# Altium schematic sheet ZBoard_2022-08-04.schdoc
size 444 x 306 mm
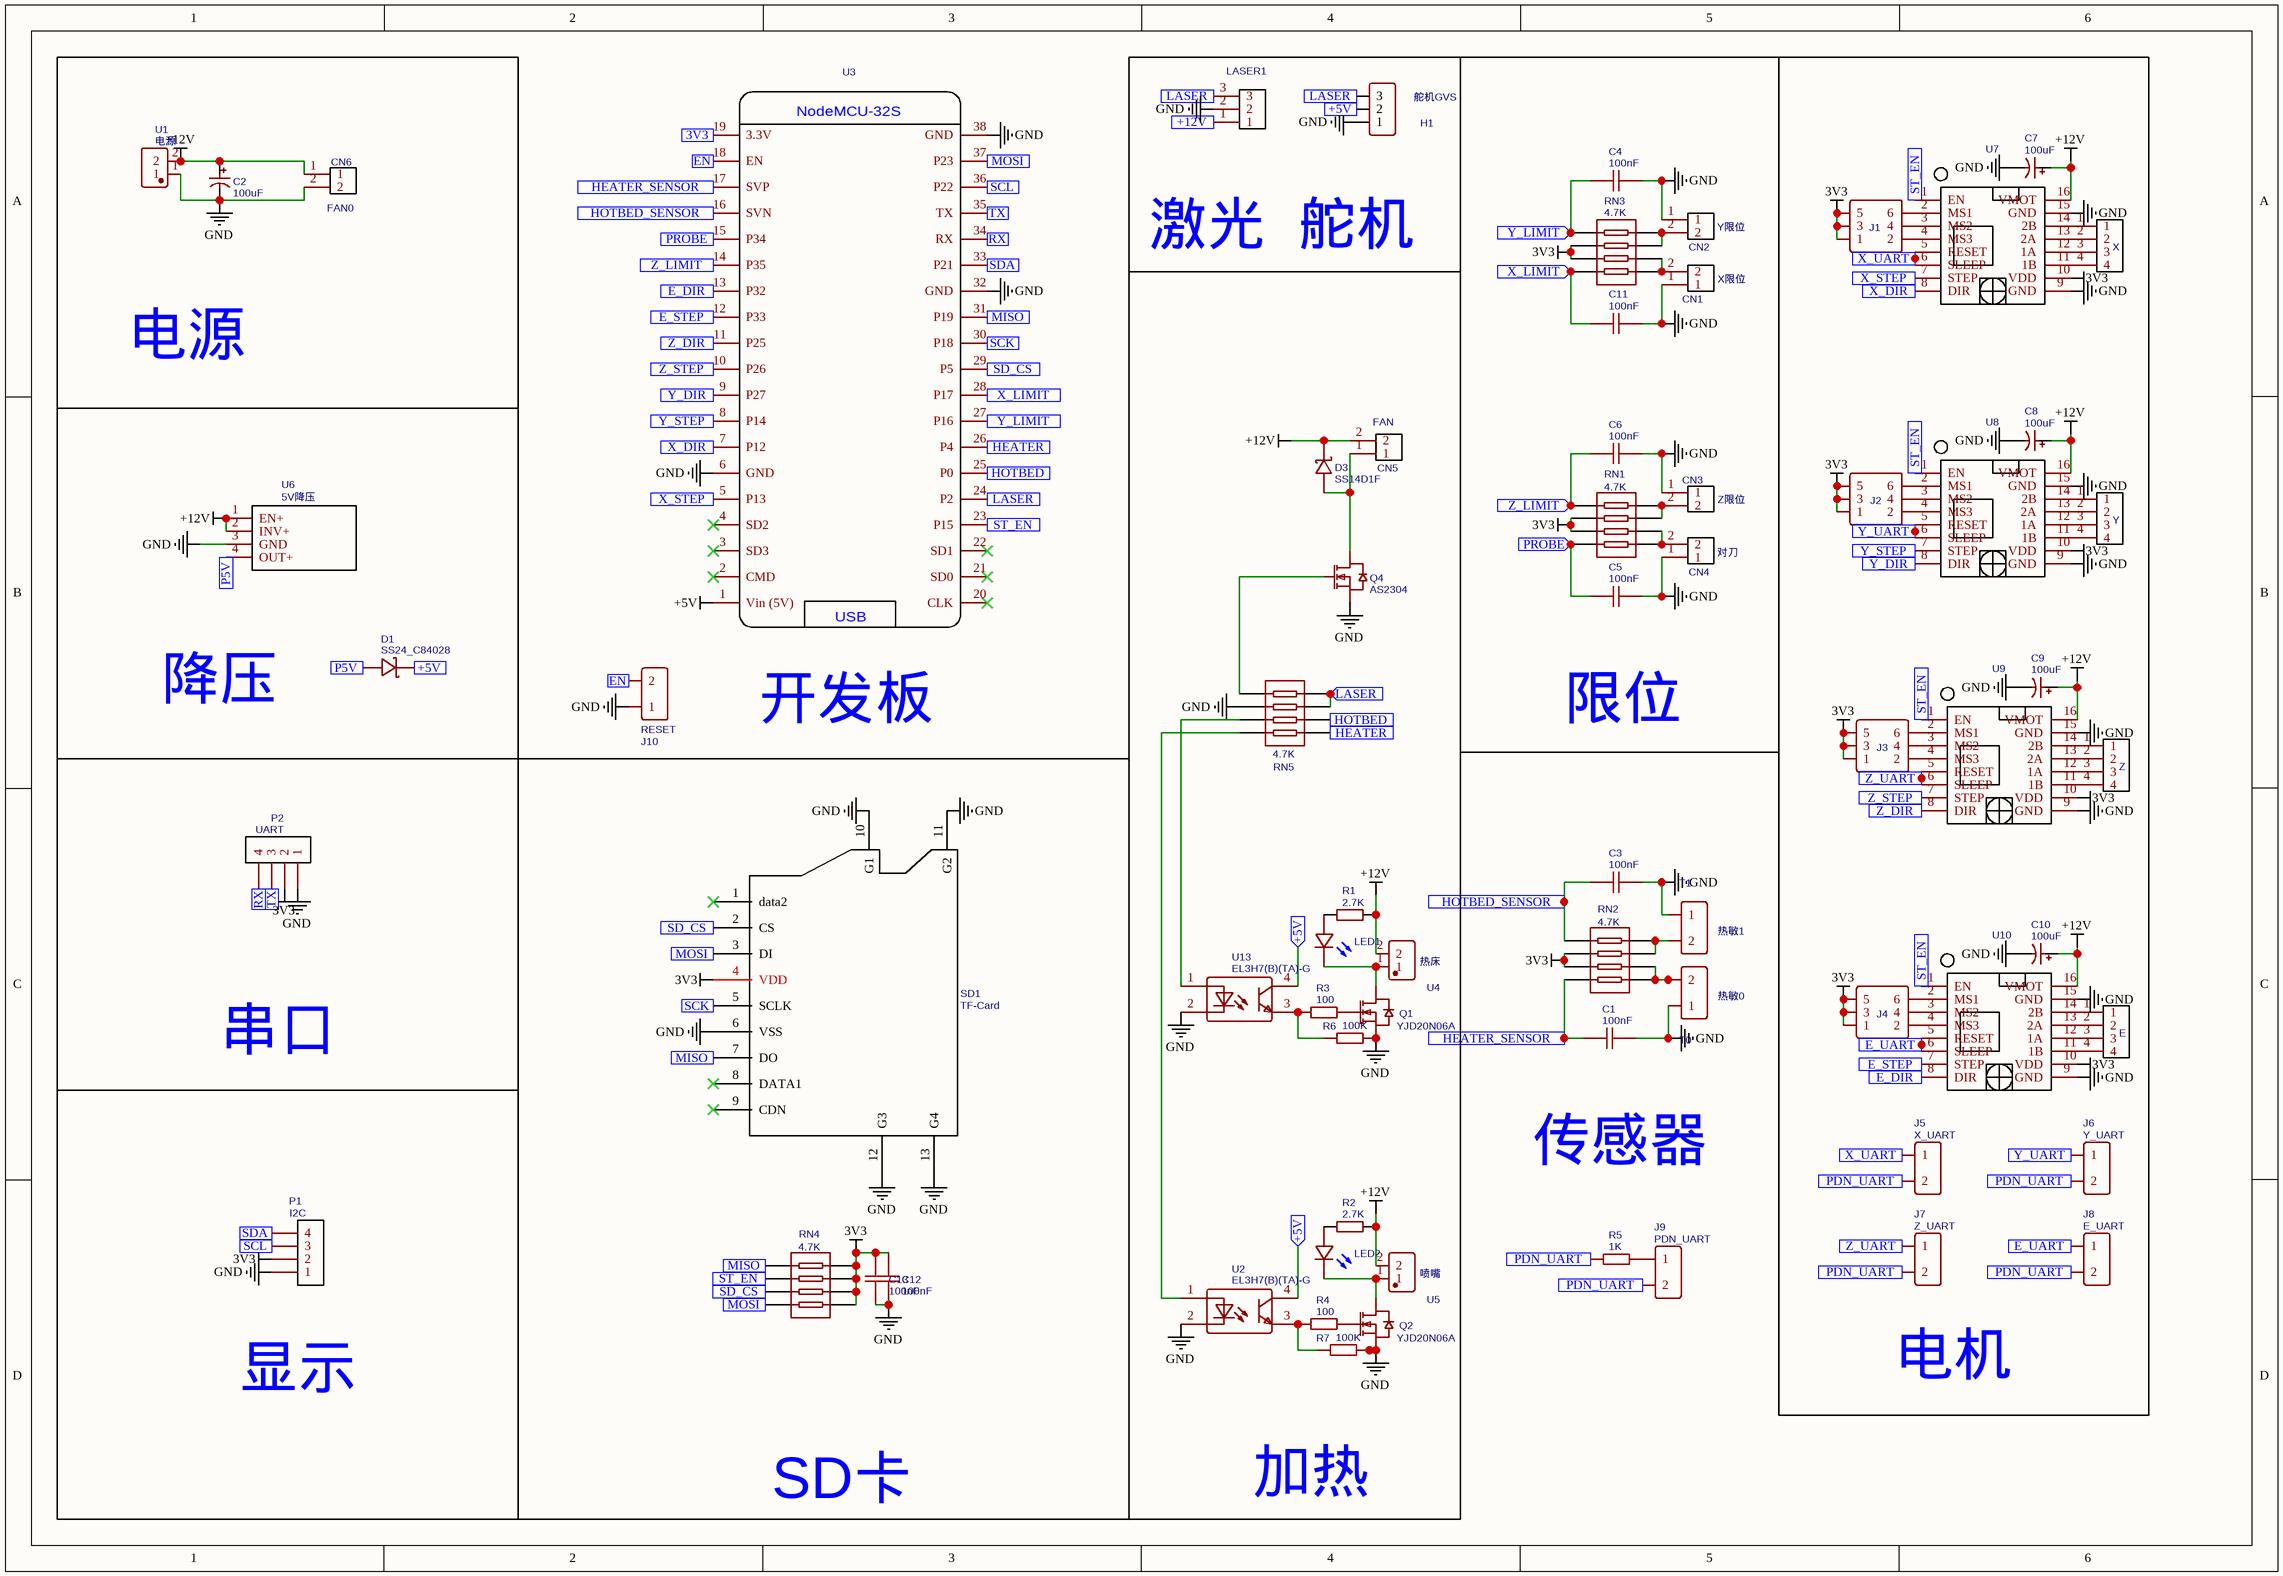
[diagram p0: ZBoard_2022-08-04.schdoc]

## Parts
C1  100nF  [C0603]
C2  100uF  [CAP-D6.3XH7.7]
C3  100nF  [C0603]
C4  100nF  [C0603]
C5  100nF  [C0603]
C6  100nF  [C0603]
C7  100uF  [CAP-D6.3XH7.7]
C8  100uF  [CAP-D6.3XH7.7]
C9  100uF  [CAP-D6.3XH7.7]
C10  100uF  [CAP-D6.3XH7.7]
C11  100nF  [C0603]
C12  100nF  [C0603]
C13  100nF  [C0603]
CN1  X限位  [CONN-TH_XH-2A]
CN2  Y限位  [CONN-TH_XH-2A]
CN3  Z限位  [CONN-TH_XH-2A]
CN4  对刀  [CONN-TH_XH-2A]
CN5  FAN  [CONN-TH_XH-2A]
CN6  FAN0  [CONN-TH_XH-2A]
D1  SS24_C84028  [DO-214AC_L4.3-W2.7-LS5.3-RD]
D3  SS14D1F  [SOD-123_L2.8-W1.8-LS3.7-RD]
E  E轴  [CONN-TH_4P-P2.50_XH-4A]  (value not drawn)
H1  舵机GVS  [HDR-TH_3P-P2.54-V]
J1  Header-Male-2.54_2x3  [HDR-TH_6P-P2.54-V-R2-C3-S2.54]  (value not drawn)
J2  Header-Male-2.54_2x3  [HDR-TH_6P-P2.54-V-R2-C3-S2.54]  (value not drawn)
J3  Header-Male-2.54_2x3  [HDR-TH_6P-P2.54-V-R2-C3-S2.54]  (value not drawn)
J4  Header-Male-2.54_2x3  [HDR-TH_6P-P2.54-V-R2-C3-S2.54]  (value not drawn)
J5  X_UART  [HDR-2X1/2.54]
J6  Y_UART  [HDR-2X1/2.54]
J7  Z_UART  [HDR-2X1/2.54]
J8  E_UART  [HDR-2X1/2.54]
J9  PDN_UART  [HDR-2X1/2.54]
J10  RESET  [HDR-2X1/2.54]
LASER1  激光VGS  [CONN-TH_XH-3A]  (value not drawn)
LED1  LED-Blue(0603)  [LED-0603-R]  (value not drawn)
LED2  LED-Blue(0603)  [LED-0603-R]  (value not drawn)
P1  I2C  [排母2.54_1X4]
P2  UART  [HDR1X4]
Q1  YJD20N06A  [TO-252-2_L6.6-W6.1-P4.57-LS9.9-BR-CW]
Q2  YJD20N06A  [TO-252-2_L6.6-W6.1-P4.57-LS9.9-BR-CW]
Q4  AS2304  [SOT-23-3_L2.9-W1.3-P1.90-LS2.4-BR]
R1  2.7K  [R0603]
R2  2.7K  [R0603]
R3  100  [R0805]
R4  100  [R0805]
R5  1K  [R0603]
R6  100K  [R0805]
R7  100K  [R0805]
RN1  4.7K  [RES-ARRAY-SMD_0603-8P-L3.2-W1.6-BL]
RN2  4.7K  [RES-ARRAY-SMD_0603-8P-L3.2-W1.6-BL]
RN3  4.7K  [RES-ARRAY-SMD_0603-8P-L3.2-W1.6-BL]
RN4  4.7K  [RES-ARRAY-SMD_0603-8P-L3.2-W1.6-BL]
RN5  4.7K  [RES-ARRAY-SMD_0603-8P-L3.2-W1.6-BL]
SD1  TF-Card  [TF卡带孔]
T0  热敏0  [CONN-TH_XH-2A]
T1  热敏1  [CONN-TH_XH-2A]
U1  电源  [CONN-TH_P5.08_KF127-5.08-2P]
U2  EL3H7(B)(TA)-G  [SOP-4_L4.4-W2.8-P1.27-LS7.0-TL]
U3  NodeMCU-32SLua  [AI-THINKER_NODEMCU-32SLUA]  (value not drawn)
U4  热床  [CONN-TH_P5.08_KF127-5.08-2P]
U5  喷嘴  [CONN-TH_P5.08_KF127-5.08-2P]
U6  5V降压  [DC_MOUDLE]
U7  4988  [A4988 STEPPER MOTOR DRIVER CARRIER]  (value not drawn)
U8  4988  [A4988 STEPPER MOTOR DRIVER CARRIER]  (value not drawn)
U9  4988  [A4988 STEPPER MOTOR DRIVER CARRIER]  (value not drawn)
U10  4988  [A4988 STEPPER MOTOR DRIVER CARRIER]  (value not drawn)
U13  EL3H7(B)(TA)-G  [SOP-4_L4.4-W2.8-P1.27-LS7.0-TL]
X  X轴  [CONN-TH_4P-P2.50_XH-4A]  (value not drawn)
Y  Y轴  [CONN-TH_4P-P2.50_XH-4A]  (value not drawn)
Z  Z轴  [CONN-TH_4P-P2.50_XH-4A]  (value not drawn)

## Blocks framed on the sheet
串口: P2
电源: C2 CN6 U1
限位: C4-C6 C11 CN1-CN4 RN1 RN3
电机: C7-C10 E J1-J8 U7-U10 X Y Z
降压: D1 U6
SD卡: C12 C13 RN4 SD1
显示: P1

## Ports
3V3 (in), +5V (in), +12V (in), E_DIR (in), E_STEP (in), E_UART (in), EN (in), HEATER (in), HEATER_SENSOR (in), HOTBED (in), HOTBED_SENSOR (in), LASER (in), MISO (in), MOSI (in), P5V (in), PDN_UART (in), PROBE (in), RX (in), SCK (in), SCL (in), SD_CS (in), SDA (in), ST_EN (in), TX (in), X_DIR (in), X_LIMIT (in), X_STEP (in), X_UART (in), Y_DIR (in), Y_LIMIT (in), Y_STEP (in), Y_UART (in), Z_DIR (in), Z_LIMIT (in), Z_STEP (in), Z_UART (in)

## Nets
3V3: C12.1 C13.1 J1.1 J1.3 J1.5 J2.1 J2.3 J2.5 J3.1 J3.3 J3.5 J4.1 J4.3 J4.5 P1.2 P2.2 RN1.2 RN1.3 RN2.2 RN2.3 RN3.2 RN3.3 RN4.5 RN4.6 RN4.7 RN4.8 SD1.4(VDD) U7.10(VDD) U8.10(VDD) U9.10(VDD) U10.10(VDD)
+5V: U3.1(Vin_(5V))
+12V: C2.1 C7.1 C8.1 C9.1 C10.1 CN5.2 CN6.1 D3.1 R1.2 R2.2 U1.2 U4.2 U5.2 U6.1(EN+) U6.2(INV+) U7.16(VMOT) U8.16(VMOT) U9.16(VMOT) U10.16(VMOT)
GND: C1.1 C2.2 C3.1 C4.1 C5.1 C6.1 C7.2 C8.2 C9.2 C10.2 C11.1 C12.2 C13.2 CN1.1 CN2.1 CN3.1 CN4.1 CN6.2 H1.1 J10.1 LASER1.2 P1.1 P2.1 Q1.3(S) Q2.3(S) Q4.2(S) R6.1 R7.1 RN5.2 SD1.6(VSS) SD1.10(G1) SD1.11(G2) SD1.12(G3) SD1.13(G4) T0.1 T1.1 U1.1 U2.2(CAT) U3.6(GND) U3.32(GND) U3.38(GND) U6.3(GND) U7.9(GND) U7.15(GND) U8.9(GND) U8.15(GND) U9.9(GND) U9.15(GND) U10.9(GND) U10.15(GND) U13.2(CAT)
3V3: U3.19(3.3V) ; port 3V3  [a separate net that carries the same name]
+5V: D1.1(K) H1.2 U2.4(COL) U13.4(COL) ; port +5V  [a separate net that carries the same name]
+12V: LASER1.1 ; port +12V  [a separate net that carries the same name]
E_DIR: U3.13(P32) U10.8(DIR) ; port E_DIR
E_STEP: U3.12(P33) U10.7(STEP) ; port E_STEP
E_UART: J8.1 U10.5(RESET) U10.6(SLEEP) ; port E_UART
EN: J10.2 U3.18(EN) ; port EN
HEATER: RN5.5 U3.26(P4) ; port HEATER
HEATER_SENSOR: C1.2 RN2.1 U3.17(SVP) ; port HEATER_SENSOR
HOTBED: RN5.6 U3.25(P0) ; port HOTBED
HOTBED_SENSOR: C3.2 RN2.4 U3.16(SVN) ; port HOTBED_SENSOR
LASER: H1.3 LASER1.3 RN5.7 RN5.8 U3.24(P2) ; port LASER
MISO: RN4.4 SD1.7(DO) U3.31(P19) ; port MISO
MOSI: RN4.1 SD1.3(DI) U3.37(P23) ; port MOSI
P5V: D1.2(A) U6.4(OUT+) ; port P5V
PDN_UART: J5.2 J6.2 J7.2 J8.2 J9.2 R5.2 ; port PDN_UART
PROBE: C5.2 RN1.1 U3.15(P34) ; port PROBE
RX: P2.4 U3.34(RX) ; port RX
SCK: SD1.5(SCLK) U3.30(P18) ; port SCK
SCL: P1.3 U3.36(P22) ; port SCL
SD_CS: RN4.2 SD1.2(CS) U3.29(P5) ; port SD_CS
SDA: P1.4 U3.33(P21) ; port SDA
ST_EN: RN4.3 U3.23(P15) U7.1(EN) U8.1(EN) U9.1(EN) U10.1(EN) ; port ST_EN
TX: P2.3 U3.35(TX) ; port TX
X_DIR: U3.7(P12) U7.8(DIR) ; port X_DIR
X_LIMIT: C11.2 RN3.4 U3.28(P17) ; port X_LIMIT
X_STEP: U3.5(P13) U7.7(STEP) ; port X_STEP
X_UART: J5.1 U7.5(RESET) U7.6(SLEEP) ; port X_UART
Y_DIR: U3.9(P27) U8.8(DIR) ; port Y_DIR
Y_LIMIT: C4.2 RN3.1 U3.27(P16) ; port Y_LIMIT
Y_STEP: U3.8(P14) U8.7(STEP) ; port Y_STEP
Y_UART: J6.1 U8.5(RESET) U8.6(SLEEP) ; port Y_UART
Z_DIR: U3.11(P25) U9.8(DIR) ; port Z_DIR
Z_LIMIT: C6.2 RN1.4 U3.14(P35) ; port Z_LIMIT
Z_STEP: U3.10(P26) U9.7(STEP) ; port Z_STEP
Z_UART: J7.1 U9.5(RESET) U9.6(SLEEP) ; port Z_UART
NetCN1_2: CN1.2 RN3.5 RN3.6
NetCN2_2: CN2.2 RN3.7 RN3.8
NetCN3_2: CN3.2 RN1.5 RN1.6
NetCN4_2: CN4.2 RN1.7 RN1.8
NetCN5_1: CN5.1 D3.2 Q4.3(D)
NetE_1: E.1 U10.14(2B)
NetE_2: E.2 U10.13(2A)
NetE_3: E.3 U10.12(1A)
NetE_4: E.4 U10.11(1B)
NetJ1_2: J1.2 U7.4(MS3)
NetJ1_4: J1.4 U7.3(MS2)
NetJ1_6: J1.6 U7.2(MS1)
NetJ2_2: J2.2 U8.4(MS3)
NetJ2_4: J2.4 U8.3(MS2)
NetJ2_6: J2.6 U8.2(MS1)
NetJ3_2: J3.2 U9.4(MS3)
NetJ3_4: J3.4 U9.3(MS2)
NetJ3_6: J3.6 U9.2(MS1)
NetJ4_2: J4.2 U10.4(MS3)
NetJ4_4: J4.4 U10.3(MS2)
NetJ4_6: J4.6 U10.2(MS1)
NetJ9_1: J9.1 R5.1
NetLED1_1: LED1.1(+) R1.1
NetLED1_2: LED1.2(-) Q1.2(D) U4.1
NetLED2_1: LED2.1(+) R2.1
NetLED2_2: LED2.2(-) Q2.2(D) U5.1
NetQ1_1: Q1.1(G) R3.1
NetQ2_1: Q2.1(G) R4.1
NetQ4_1: Q4.1(G) RN5.1
NetR3_2: R3.2 R6.2 U13.3(EM)
NetR4_2: R4.2 R7.2 U2.3(EM)
NetRN2_5: RN2.5 RN2.6 T1.2
NetRN2_7: RN2.7 RN2.8 T0.2
NetRN5_3: RN5.3 U13.1(AN)
NetRN5_4: RN5.4 U2.1(AN)
NetU7_11: U7.11(1B) X.4
NetU7_12: U7.12(1A) X.3
NetU7_13: U7.13(2A) X.2
NetU7_14: U7.14(2B) X.1
NetU8_11: U8.11(1B) Y.4
NetU8_12: U8.12(1A) Y.3
NetU8_13: U8.13(2A) Y.2
NetU8_14: U8.14(2B) Y.1
NetU9_11: U9.11(1B) Z.4
NetU9_12: U9.12(1A) Z.3
NetU9_13: U9.13(2A) Z.2
NetU9_14: U9.14(2B) Z.1

Not connected (* = marked no-connect by the designer): SD1 1(data2)* 8(DATA1)* 9(CDN)*; U3 2(CMD)* 3(SD3)* 4(SD2)* 20(CLK)* 21(SD0)* 22(SD1)*

## Notes on the sheet
- 激光
- 舵机
- 开发板
- 传感器
- 加热
- (in symbol NodeMCU-32SLua) NodeMCU-32S; USB

## Library data of the parts
C1 C3-C6 C11-C13 = 100nF: BOM_Manufacturer Part: CC0603KRX7R9BB104; BOM_Manufacturer: YAGEO; BOM_Description: Cap, 0.1uF, 25V, X7R; Value: 100nF; spicePre: C; spiceSymbolName: 100nF; BOM_Supplier Part: C14663; BOM_Supplier: LCSC
C2 C7-C10 = 100uF: BOM_Manufacturer: CapXon; BOM_Manufacturer Part: VE-101M1VTR-0607; Voltage: 25V; BOM_EasyEDA: E59935; Value: 100uF; BOM_Supplier Part: C171732; BOM_Supplier: LCSC; spicePre: C; spiceSymbolName: 100uF
CN1 = X限位: BOM_Manufacturer: BOOMELE; BOM_Manufacturer Part: XH-2A; SMT Type: Extend; BOM_Supplier: LCSC; image: //image.lceda.cn/szlcsc/C20079.jpg; BOM_Supplier Part: C20079; BOM_JLCPCB SMD: Yes; spicePre: C; spiceSymbolName: XH-2A
CN2 = Y限位: BOM_Manufacturer: BOOMELE; BOM_Manufacturer Part: XH-2A; SMT Type: Extend; BOM_Supplier: LCSC; image: //image.lceda.cn/szlcsc/C20079.jpg; BOM_Supplier Part: C20079; BOM_JLCPCB SMD: Yes; spicePre: C; spiceSymbolName: XH-2A
CN3 = Z限位: BOM_Manufacturer: BOOMELE; BOM_Manufacturer Part: XH-2A; SMT Type: Extend; BOM_Supplier: LCSC; image: //image.lceda.cn/szlcsc/C20079.jpg; BOM_Supplier Part: C20079; BOM_JLCPCB SMD: Yes; spicePre: C; spiceSymbolName: XH-2A
CN4 = 对刀: BOM_Manufacturer: BOOMELE; BOM_Manufacturer Part: XH-2A; SMT Type: Extend; BOM_Supplier: LCSC; image: //image.lceda.cn/szlcsc/C20079.jpg; BOM_Supplier Part: C20079; BOM_JLCPCB SMD: Yes; spicePre: C; spiceSymbolName: XH-2A
CN5 = FAN: BOM_Manufacturer: BOOMELE; BOM_Manufacturer Part: XH-2A; SMT Type: Extend; BOM_Supplier: LCSC; image: //image.lceda.cn/szlcsc/C20079.jpg; BOM_Supplier Part: C20079; BOM_JLCPCB SMD: Yes; spicePre: C; spiceSymbolName: XH-2A
CN6 = FAN0: BOM_Manufacturer: BOOMELE; BOM_Manufacturer Part: XH-2A; SMT Type: Extend; BOM_Supplier: LCSC; image: //image.lceda.cn/szlcsc/C20079.jpg; BOM_Supplier Part: C20079; BOM_JLCPCB SMD: Yes; spicePre: C; spiceSymbolName: XH-2A
D1 = SS24_C84028: BOM_Manufacturer Part: SS24; BOM_Manufacturer: STARSEA; BOM_Supplier: LCSC; BOM_Supplier Part: C84028; BOM_JLCPCB Part Class: Extended Part; spicePre: D; spiceSymbolName: SS24_C84028
D3 = SS14D1F: BOM_Manufacturer: PN SILICON; Contributor: LCSC; BOM_Supplier: LCSC; BOM_Supplier Part: C555467; BOM_Manufacturer Part: SS14D1F; BOM_JLCPCB Part Class: Extended Part; spicePre: D; spiceSymbolName: SS14D1F
E = E轴: BOM_Manufacturer: BOOMELE; BOM_Manufacturer Part: XH-4A; BOM_Supplier: LCSC; image: //image.lceda.cn/szlcsc/C37815.jpg; BOM_Supplier Part: C37815; spicePre: C; spiceSymbolName: XH-4A
H1 = 舵机GVS: BOM_Manufacturer: BOOMELE; BOM_Manufacturer Part: Header2.54mm 1*3P; BOM_Paste Type: expand; BOM_Assembly Type: manualWeld; BOM_Supplier: LCSC; image: //image.lceda.cn/szlcsc/C49257.jpg; BOM_Supplier Part: C49257; spicePre: H; spiceSymbolName: Header-Male-2.54_1x3
J1-J4 = Header-Male-2.54_2x3: BOM_Manufacturer: BOOMELE; BOM_Supplier: LCSC; BOM_Manufacturer Part: Header-Male-2.54_2x3; BOM_Supplier Part: C65114; spicePre: J; spiceSymbolName: Header-Male-2.54_2x3
J5 = X_UART: BOM_Manufacturer: TE Connectivity; BOM_Manufacturer Part: 826629-2; BOM_Supplier Part: C86471; BOM_Supplier: LCSC; image: //image.lceda.cn/szlcsc/C86471.jpg; link: //image.lceda.cn/szlcsc/C86471.jpg; spicePre: J; spiceSymbolName: J-Header-Male-2.54_1x2
J6 = Y_UART: BOM_Manufacturer: TE Connectivity; BOM_Manufacturer Part: 826629-2; BOM_Supplier Part: C86471; BOM_Supplier: LCSC; image: //image.lceda.cn/szlcsc/C86471.jpg; link: //image.lceda.cn/szlcsc/C86471.jpg; spicePre: J; spiceSymbolName: J-Header-Male-2.54_1x2
J7 = Z_UART: BOM_Manufacturer: TE Connectivity; BOM_Manufacturer Part: 826629-2; BOM_Supplier Part: C86471; BOM_Supplier: LCSC; image: //image.lceda.cn/szlcsc/C86471.jpg; link: //image.lceda.cn/szlcsc/C86471.jpg; spicePre: J; spiceSymbolName: J-Header-Male-2.54_1x2
J8 = E_UART: BOM_Manufacturer: TE Connectivity; BOM_Manufacturer Part: 826629-2; BOM_Supplier Part: C86471; BOM_Supplier: LCSC; image: //image.lceda.cn/szlcsc/C86471.jpg; link: //image.lceda.cn/szlcsc/C86471.jpg; spicePre: J; spiceSymbolName: J-Header-Male-2.54_1x2
J9 = PDN_UART: BOM_Manufacturer: TE Connectivity; BOM_Manufacturer Part: 826629-2; BOM_Supplier Part: C86471; BOM_Supplier: LCSC; image: //image.lceda.cn/szlcsc/C86471.jpg; link: //image.lceda.cn/szlcsc/C86471.jpg; spicePre: J; spiceSymbolName: J-Header-Male-2.54_1x2
J10 = RESET: BOM_Manufacturer: TE Connectivity; BOM_Manufacturer Part: 826629-2; BOM_Supplier Part: C86471; BOM_Supplier: LCSC; image: //image.lceda.cn/szlcsc/C86471.jpg; link: //image.lceda.cn/szlcsc/C86471.jpg; spicePre: J; spiceSymbolName: J-Header-Male-2.54_1x2
LASER1 = 激光VGS: BOM_Manufacturer: BOOMELE; BOM_Manufacturer Part: XH-3A; BOM_Supplier: LCSC; image: //image.lceda.cn/szlcsc/C2316.jpg; BOM_Supplier Part: C2316; spicePre: C; spiceSymbolName: XH-3A
LED1 LED2 = LED-Blue(0603): BOM_Manufacturer: EVERLIGHT; BOM_Manufacturer Part: 19-217/BHC-ZL1M2RY/3T; BOM_Supplier: LCSC; BOM_Supplier Part: C72041; spicePre: L; spiceSymbolName: LED-Blue(0603)
P1 = I2C: Contributor: dullsong; spicePre: P; spiceSymbolName: I2C
P2 = UART: Contributor: dullsong; spicePre: P; spiceSymbolName: I2C
Q1 Q2 = YJD20N06A: BOM_Manufacturer: YANGJIE(扬杰); Contributor: LCSC; BOM_Supplier: LCSC; BOM_Supplier Part: C699275; BOM_Manufacturer Part: YJD20N06A; spicePre: Q; spiceSymbolName: RFD16N06LE
Q4 = AS2304: BOM_Manufacturer: AnBon; Contributor: LCSC; BOM_Supplier: LCSC; BOM_Supplier Part: C232268; BOM_Manufacturer Part: AS2304; BOM_JLCPCB Part Class: Extended Part; spicePre: Q; spiceSymbolName: AS2304
R1 R2 = 2.7K: BOM_Manufacturer: UniOhm; BOM_Manufacturer Part: 0603WAF2701T5E; nameAlias: Resistance (Ohms); BOM_Supplier: LCSC; BOM_Supplier Part: C13167; BOM_JLCPCB Part Class: Basic Part; spicePre: R; spiceSymbolName: 0603WAF2701T5E
R3 = 100: BOM_Manufacturer: ResistorToday; BOM_Manufacturer Part: 0603WAF1000T5E; nameAlias: Resistance (Ohms); Contributor: LCSC; BOM_Supplier: LCSC; BOM_Supplier Part: C22775; spicePre: R; spiceSymbolName: AECR0805F100KK9
R4 = 100: BOM_Manufacturer: UNIOHM 台湾厚声; BOM_Manufacturer Part: 0603WAF1000T5E; nameAlias: Resistance (Ohms); Contributor: LCSC; BOM_Supplier: LCSC; BOM_Supplier Part: C22775; spicePre: R; spiceSymbolName: AECR0805F100KK9
R5 = 1K: BOM_Manufacturer: ResistorToday; BOM_Manufacturer Part: 0603WAF1000T5E; nameAlias: Resistance (Ohms); Contributor: LCSC; BOM_Supplier: LCSC; BOM_Supplier Part: C22775; spicePre: R; spiceSymbolName: AECR0805F100KK9
R6 R7 = 100K: BOM_Manufacturer: UNIOHM 台湾厚声; BOM_Manufacturer Part: 0603WAF1003T5E; nameAlias: Resistance (Ohms); Contributor: LCSC; BOM_Supplier: LCSC; BOM_Supplier Part: C25803; spicePre: R; spiceSymbolName: AECR0805F100KK9
RN1-RN5 = 4.7K: BOM_Manufacturer: UniOhm; BOM_Manufacturer Part: 4D03WGF4701T5E; nameAlias: Resistance (Ohms); BOM_Paste Type: expand; BOM_Assembly Type: smtWeld; BOM_Supplier: LCSC; BOM_Supplier Part: C66697; spicePre: R; spiceSymbolName: 4D03WGF4701T5E
SD1 = TF-Card: BOM_Manufacturer: XUNPU(讯普); BOM_Manufacturer Part: TF-115-BCP9; BOM_Supplier: LCSC; BOM_Supplier Part: C720505; spicePre: S; spiceSymbolName: TF-Card
T0 = 热敏0: BOM_Manufacturer: TE Connectivity; BOM_Manufacturer Part: 826629-2; SMT Type: Extend; BOM_Supplier: LCSC; image: //image.lceda.cn/szlcsc/C86471.jpg; BOM_Supplier Part: C86471; BOM_JLCPCB SMD: Yes; spicePre: H; spiceSymbolName: Header-Male-2.54_1x2
T1 = 热敏1: BOM_Manufacturer: TE Connectivity; BOM_Manufacturer Part: 826629-2; SMT Type: Extend; BOM_Supplier: LCSC; image: //image.lceda.cn/szlcsc/C86471.jpg; BOM_Supplier Part: C86471; BOM_JLCPCB SMD: Yes; spicePre: H; spiceSymbolName: Header-Male-2.54_1x2
U1 = 电源: BOM_Manufacturer: Cixi Kefa Elec; BOM_Manufacturer Part: KF127-5.08-2P; Contributor: LCSC; BOM_Supplier: LCSC; BOM_Supplier Part: C474906; spicePre: U; spiceSymbolName: KF127-5.08-2P
U2 U13 = EL3H7(B)(TA)-G: BOM_Manufacturer: EVERLIGHT; BOM_Supplier: LCSC; BOM_Manufacturer Part: EL3H7(B)(TA)-G; BOM_Supplier Part: C32565; BOM_JLCPCB Part Class: Basic Part; spicePre: U; spiceSymbolName: EL3H7(B)(TA)-G
U3 = NodeMCU-32SLua: BOM_Manufacturer: Ai-Thinker; Contributor: EasyEDA; spicePre: X; BOM_Supplier: LCSC; BOM_Supplier Part: C111436; BOM_Manufacturer Part: NodeMCU-32SLua; link: https://lcsc.com/product-detail/Modules_NodeMCU-32S-Lua_C111436.html; spiceSymbolName: NodeMCU-32SLua
U4 = 热床: BOM_Manufacturer: Cixi Kefa Elec; BOM_Manufacturer Part: KF127-5.08-2P; Contributor: LCSC; BOM_Supplier: LCSC; BOM_Supplier Part: C474906; spicePre: U; spiceSymbolName: KF127-5.08-2P
U5 = 喷嘴: BOM_Manufacturer: Cixi Kefa Elec; BOM_Manufacturer Part: KF127-5.08-2P; Contributor: LCSC; BOM_Supplier: LCSC; BOM_Supplier Part: C474906; spicePre: U; spiceSymbolName: KF127-5.08-2P
U6 = 5V降压: Contributor: SZMIC_612; spicePre: U; spiceSymbolName: DC_MOUDLE
U7-U10 = 4988: BOM_Manufacturer Part: New SchematicLib; Contributor: YunChe; spicePre: U; spiceSymbolName: 4988
X = X轴: BOM_Manufacturer: BOOMELE; BOM_Manufacturer Part: XH-4A; BOM_Supplier: LCSC; image: //image.lceda.cn/szlcsc/C37815.jpg; BOM_Supplier Part: C37815; spicePre: C; spiceSymbolName: XH-4A
Y = Y轴: BOM_Manufacturer: BOOMELE; BOM_Manufacturer Part: XH-4A; BOM_Supplier: LCSC; image: //image.lceda.cn/szlcsc/C37815.jpg; BOM_Supplier Part: C37815; spicePre: C; spiceSymbolName: XH-4A
Z = Z轴: BOM_Manufacturer: BOOMELE; BOM_Manufacturer Part: XH-4A; BOM_Supplier: LCSC; image: //image.lceda.cn/szlcsc/C37815.jpg; BOM_Supplier Part: C37815; spicePre: C; spiceSymbolName: XH-4A